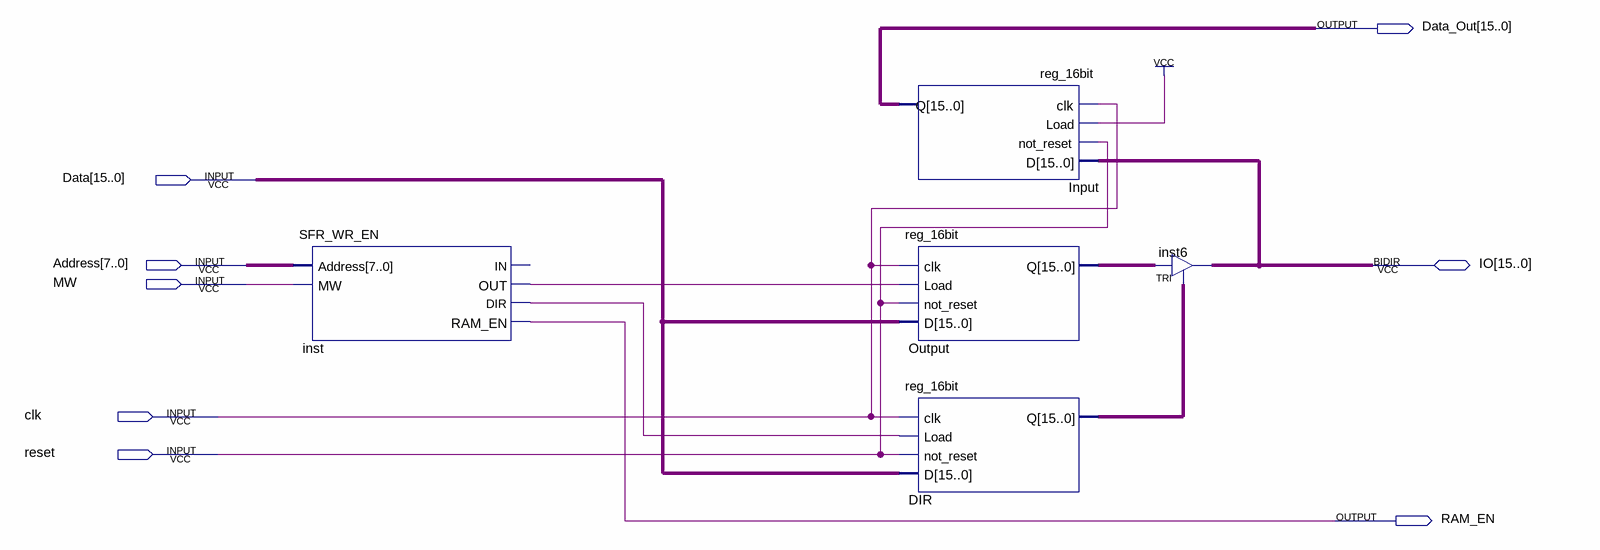
[diagram p0: schematic sheet]
// Quartus schematic SFR.bdf as structural Verilog: 5 symbols, 8 pins
module SFR (
  input  [15:0] Data,
  input  [7:0] Address,
  input  MW,
  input  clk,
  input  reset,
  inout  [15:0] IO,
  output [15:0] Data_Out,
  output RAM_EN
);

  wire inst_dir, inst_out;
  wire [15:0] DIR_q, Output_q;

  SFR_WR_EN inst (.Address(Address), .MW(MW), .OUT(inst_out), .DIR(inst_dir), .RAM_EN(RAM_EN));  // open: IN
  reg_16bit Input (.clk(clk), .Load(1'b1), .not_reset(reset), .D(IO), .Q(Data_Out));
  reg_16bit Output (.clk(clk), .Load(inst_out), .not_reset(reset), .D(Data), .Q(Output_q));
  reg_16bit DIR (.clk(clk), .Load(inst_dir), .not_reset(reset), .D(Data), .Q(DIR_q));
  TRI inst6[15:0] (.IN(Output_q), .OE(DIR_q), .OUT(IO));
endmodule
